# Altium project Localization.PrjPcb
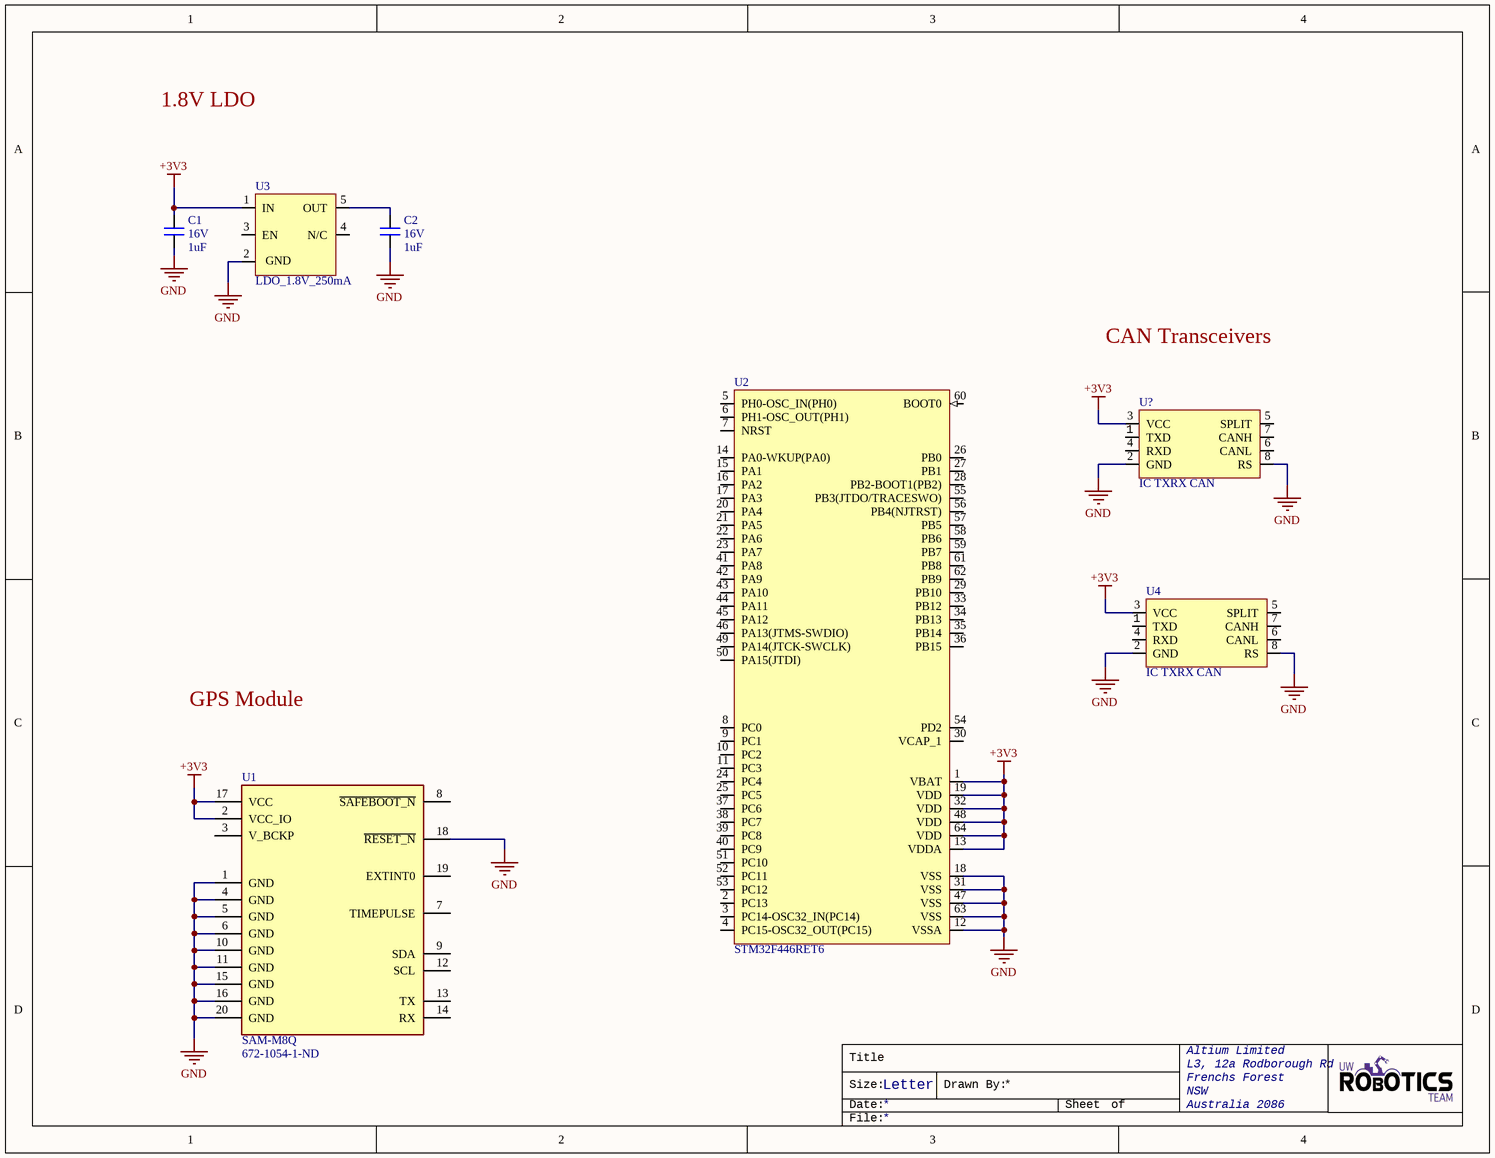
[diagram p0: Localization.SchDoc]
1 sheet, 7 parts. Net scope: global (net labels, ports and power ports of the same name join across sheets).
Board file: Localization.PcbDoc

## Sheet Localization.SchDoc
size Letter; Organization: Altium Limited; Address1: L3, 12a Rodborough Rd; Address2: Frenchs Forest; Address3: NSW; Address4: Australia 2086

### Parts
C1  value 1uF  Voltage Rating: 16V  [CAPC0603(1608)55_N]  (hidden comment: CAP_1uF_16V_0603)
C2  value 1uF  Voltage Rating: 16V  [CAPC0603(1608)55_N]  (hidden comment: CAP_1uF_16V_0603)
U1  SAM-M8Q  Supplier Part Number 1: 672-1054-1-ND
U2  STM32F446RET6  [STM_LQFP64_N]
U3  LDO_1.8V_250mA  [LP5907MFX-1.8/NOPB]
U4  IC TXRX CAN  [LT-S8_N]
U?  IC TXRX CAN  [LT-S8_N]

### Nets
+3V3: C1.2 U1.2(VCC_IO) U1.17(VCC) U2.1(VBAT) U2.13(VDDA) U2.19(VDD) U2.32(VDD) U2.48(VDD) U2.64(VDD) U3.1(IN) U4.3(VCC) U?.3(VCC)
GND: C1.1 C2.1 U1.1(GND) U1.4(GND) U1.5(GND) U1.6(GND) U1.10(GND) U1.11(GND) U1.15(GND) U1.16(GND) U1.18(~{RESET_N}) U1.20(GND) U2.12(VSSA) U2.18(VSS) U2.31(VSS) U2.47(VSS) U2.63(VSS) U3.2(GND) U4.2(GND) U4.8(RS) U?.2(GND) U?.8(RS)
NetC2_2: C2.2 U3.5(OUT)

Not connected (* = marked no-connect by the designer): U1 3(V_BCKP) 7(TIMEPULSE) 8(~{SAFEBOOT_N}) 9(SDA) 12(SCL) 13(TX) 14(RX) 19(EXTINT0); U2 2(PC13) 3(PC14-OSC32_IN(PC14)) 4(PC15-OSC32_OUT(PC15)) 5(PH0-OSC_IN(PH0)) 6(PH1-OSC_OUT(PH1)) 7(NRST) 8(PC0) 9(PC1) 10(PC2) 11(PC3) 14(PA0-WKUP(PA0)) 15(PA1) 16(PA2) 17(PA3) 20(PA4) 21(PA5) 22(PA6) 23(PA7) 24(PC4) 25(PC5) 26(PB0) 27(PB1) 28(PB2-BOOT1(PB2)) 29(PB10) 30(VCAP_1) 33(PB12) 34(PB13) 35(PB14) 36(PB15) 37(PC6) 38(PC7) 39(PC8) 40(PC9) 41(PA8) 42(PA9) 43(PA10) 44(PA11) 45(PA12) 46(PA13(JTMS-SWDIO)) 49(PA14(JTCK-SWCLK)) 50(PA15(JTDI)) 51(PC10) 52(PC11) 53(PC12) 54(PD2) 55(PB3(JTDO/TRACESWO)) 56(PB4(NJTRST)) 57(PB5) 58(PB6) 59(PB7) 60(BOOT0) 61(PB8) 62(PB9); U3 3(EN) 4(N/C); U4 1(TXD) 4(RXD) 5(SPLIT) 6(CANL) 7(CANH); U? 1(TXD) 4(RXD) 5(SPLIT) 6(CANL) 7(CANH)

### Notes on the sheet
- 1.8V LDO
- CAN Transceivers
- GPS Module
- Title
- Size:
- Date:
- Letter
- Drawn By:
- Sheet
- of
- File:

### Library data of the parts
C1 C2 = CAP_1uF_16V_0603: CAP CER 1UF 16V Y5V 0603; Manufacturer Part Number: CC0603ZRY5V7BB105; Manufacturer 1: Yageo; Dimensions: 0.063" L x 0.031" W (1.60mm x 0.80mm); Package: 0603 (1608 Metric); Temperature Coefficient: Y5V; Supplier Part Number 1: 311-1372-1-ND; Supplier 1: Digi-Key; Mount: Surface Mount
U1 = SAM-M8Q: Rf Rx Galileo 1.575GHZ/1.602GHZ; Manufacturer 1: u-blox; Manufacturing Part Number 1: SAM-M8Q-0-10; Interface: I2C,SPI,USB,UART; Sensitivity: -165dBm; Data Rate: 400Kbps; Supplier 1: Digi-Key; RoHS: No; Stock 1: 2191; Pricing 1: 1=25.00000, 10=20.24400, 50=16.62160, 100=13.26160 (USD); Case/Package: SMD/SMT; Min Operating Temperature: -40°C; Max Operating Temperature: 85°C; Packaging: Tape and Reel; Frequency: 1.602GHz; ComponentLink1URL: https://www.u-blox.com/sites/default/files/SAM-M8Q_ProductSummary_%28UBX-15027452%29.pdf?src-supplier=Digi-Key; ComponentLink1Description: https://www.u-blox.com/sites/default/files/SAM-M8Q_ProductSummary_%28UBX-15027452%29.pdf?src-supplier=Digi-Key; ComponentLink2URL: https://www.u-blox.com/sites/default/files/SAM-M8Q_DataSheet_%28UBX-16012619%29.pdf?src-supplier=Digi-Key; ComponentLink2Description: https://www.u-blox.com/sites/default/files/SAM-M8Q_DataSheet_%28UBX-16012619%29.pdf?src-supplier=Digi-Key
U2 = STM32F446RET6: IC MCU 32BIT 512KB FLASH 64LQFP; Manufacturer 1: STMicroelectronics; Manufacturer Part Number 1: LF80CDT-TR; Supplier 1: Digi-Key; Supplier Part Number 1: 497-15376-ND; Mount: Surface Mount
U3 = LDO_1.8V_250mA: IC REG LINEAR 1.8V 250MA SOT23-5; Manufacturer 1: Texas Instruments; Manufacturer Part Number 1: LP5907MFX-1.8/NOPB; Current Output: 250mA; Supplier Part Number 1: 296-41463-1-ND; Supplier 1: Digi-Key; Mount: Surface Mount
U4 U? = LTC2875: IC TXRX CAN 4MBPS 8SO; Manufacturer 1: Linear Technologies; Manufacturer Part Number 1: LTC2875IS8#PBF; Package: 8-SOIC (0.154", 3.90mm Width); ComponentLink1Description: Datasheet; ComponentLink1URL: https://www.analog.com/media/en/technical-documentation/data-sheets/2875f.pdf; Supplier Part Number 1: LTC2875IS8#PBF-ND; Supplier 1: Digi-Key; Mount: Surface Mount